# Altium schematic sheet Sheet1.SchDoc
size A4
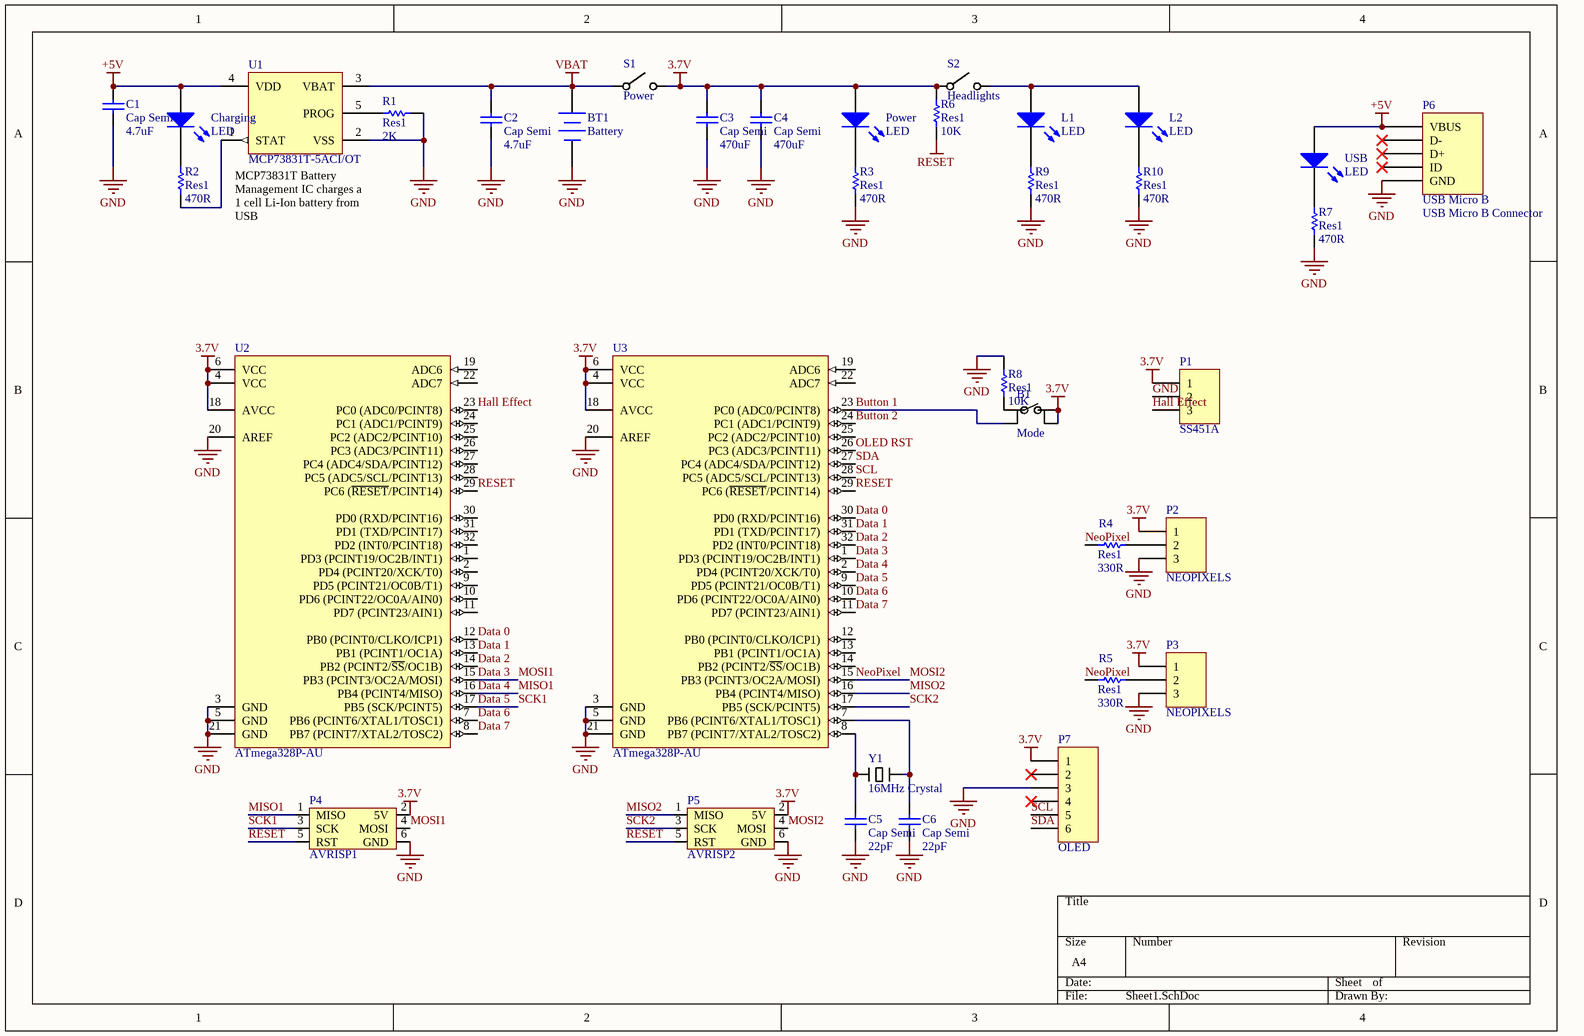
[diagram p0: Sheet1.SchDoc]

## Parts
B1  Mode  [SPST-NO]
BT1  Battery  [BAT-2]
C1  Cap Semi  value 4.7uF  [1608[0603]]
C2  Cap Semi  value 4.7uF  [1608[0603]]
C3  Cap Semi  value 470uF  [CAPAE9983X105M]
C4  Cap Semi  value 470uF  [CAPAE9983X105M]
C5  Cap Semi  value 22pF  [1608[0603]]
C6  Cap Semi  value 22pF  [1608[0603]]
Charging  LED  [LED0603]
L1  LED  [HDR1X2]
L2  LED  [HDR1X2]
P1  SS451A  [HDR1X3]
P2  NEOPIXELS  [HDR1X3]
P3  NEOPIXELS  [HDR1X3]
P4  AVRISP1  [HDR2X3]
P5  AVRISP2  [HDR2X3]
P6  USB Micro B Connector  [USB Micro B Connector]
P7  OLED  [HDR1X6]
Power  LED  [LED0603]
R1  Res1  value 2K  [1608[0603]]
R2  Res1  value 470R  [1608[0603]]
R3  Res1  value 470R  [1608[0603]]
R4  Res1  value 330R  [1608[0603]]
R5  Res1  value 330R  [1608[0603]]
R6  Res1  value 10K  [1608[0603]]
R7  Res1  value 470R  [1608[0603]]
R8  Res1  value 10K  [1608[0603]]
R9  Res1  value 470R  [1608[0603]]
R10  Res1  value 470R  [1608[0603]]
S1  Power  [Slide Switch 2.54mm]
S2  Headlights  [Slide Switch 2.54mm]
U1  MCP73831T-5ACI/OT  [SOT-23-OT5_N]
U2  ATmega328P-AU  [32A_N]
U3  ATmega328P-AU  [32A_N]
USB  LED  [LED0603]
Y1  16MHz Crystal  [16MHz Clock]

## Nets
3.7V: B1.3 B1.4 C3.2 C4.2 P1.1 P2.1 P3.1 P4.2(5V) P5.2(5V) P7.1 Power.1(A) R6.1 S1.2 S2.1 U2.4(VCC) U2.6(VCC) U2.18(AVCC) U3.4(VCC) U3.6(VCC) U3.18(AVCC)
+5V: C1.2 Charging.1(A) P6.VBUS U1.4(VDD) USB.1(A)
GND: BT1.2(-) C1.1 C2.1 C3.1 C4.1 C5.1 C6.1 P1.2 P2.3 P3.3 P4.6(GND) P5.6(GND) P6.GND P7.3 R1.1 R3.1 R7.1 R8.1 R9.1 R10.1 U1.2(VSS) U2.3(GND) U2.5(GND) U2.20(AREF) U2.21(GND) U3.3(GND) U3.5(GND) U3.20(AREF) U3.21(GND)
RESET: P4.5(RST) P5.5(RST) R6.2 U2.29(PC6_(~{RESET}/PCINT14)) U3.29(PC6_(~{RESET}/PCINT14))
VBAT: BT1.1(+) C2.2 S1.1 U1.3(VBAT)
Button 1: B1.2 U3.23(PC0_(ADC0/PCINT8))
Button 2: U3.24(PC1_(ADC1/PCINT9))
Data 0: U2.12(PB0_(PCINT0/CLKO/ICP1)) U3.30(PD0_(RXD/PCINT16))
Data 1: U2.13(PB1_(PCINT1/OC1A)) U3.31(PD1_(TXD/PCINT17))
Data 2: U2.14(PB2_(PCINT2/~{SS}/OC1B)) U3.32(PD2_(INT0/PCINT18))
Data 3: P4.4(MOSI) U2.15(PB3_(PCINT3/OC2A/MOSI)) U3.1(PD3_(PCINT19/OC2B/INT1))  [also labelled MOSI1]
Data 4: P4.1(MISO) U2.16(PB4_(PCINT4/MISO)) U3.2(PD4_(PCINT20/XCK/T0))  [also labelled MISO1]
Data 5: P4.3(SCK) U2.17(PB5_(SCK/PCINT5)) U3.9(PD5_(PCINT21/OC0B/T1))  [also labelled SCK1]
Data 6: U2.7(PB6_(PCINT6/XTAL1/TOSC1)) U3.10(PD6_(PCINT22/OC0A/AIN0))
Data 7: U2.8(PB7_(PCINT7/XTAL2/TOSC2)) U3.11(PD7_(PCINT23/AIN1))
Hall Effect: P1.3 U2.23(PC0_(ADC0/PCINT8))
MISO2: P5.1(MISO) U3.16(PB4_(PCINT4/MISO))
MOSI2: P5.4(MOSI) R4.1 R5.1 U3.15(PB3_(PCINT3/OC2A/MOSI))  [also labelled NeoPixel]
OLED RST: U3.26(PC3_(ADC3/PCINT11))
SCK2: P5.3(SCK) U3.17(PB5_(SCK/PCINT5))
SCL: P7.5 U3.28(PC5_(ADC5/SCL/PCINT13))
SDA: P7.6 U3.27(PC4_(ADC4/SDA/PCINT12))
NetB1_1: B1.1 R8.2
NetC5_2: C5.2 U3.8(PB7_(PCINT7/XTAL2/TOSC2)) Y1.1
NetC6_2: C6.2 U3.7(PB6_(PCINT6/XTAL1/TOSC1)) Y1.2
NetCharging_2: Charging.2(K) R2.2
NetL1_1: L1.1(A) L2.1(A) S2.2
NetL1_2: L1.2(K) R9.2
NetL2_2: L2.2(K) R10.2
NetP2_2: P2.2 R4.2
NetP3_2: P3.2 R5.2
NetPower_2: Power.2(K) R3.2
NetR1_2: R1.2 U1.5(PROG)
NetR2_1: R2.1 U1.1(STAT)
NetR7_2: R7.2 USB.2(K)

Not connected (* = marked no-connect by the designer): P6 D+* D-* ID*; P7 2* 4*; U2 1(PD3_(PCINT19/OC2B/INT1)) 2(PD4_(PCINT20/XCK/T0)) 9(PD5_(PCINT21/OC0B/T1)) 10(PD6_(PCINT22/OC0A/AIN0)) 11(PD7_(PCINT23/AIN1)) 19(ADC6) 22(ADC7) 24(PC1_(ADC1/PCINT9)) 25(PC2_(ADC2/PCINT10)) 26(PC3_(ADC3/PCINT11)) 27(PC4_(ADC4/SDA/PCINT12)) 28(PC5_(ADC5/SCL/PCINT13)) 30(PD0_(RXD/PCINT16)) 31(PD1_(TXD/PCINT17)) 32(PD2_(INT0/PCINT18)); U3 12(PB0_(PCINT0/CLKO/ICP1)) 13(PB1_(PCINT1/OC1A)) 14(PB2_(PCINT2/~{SS}/OC1B)) 19(ADC6) 22(ADC7) 25(PC2_(ADC2/PCINT10))

## Notes on the sheet
- (near U1) MCP73831T Battery Management IC charges a 1 cell Li-Ion battery from USB
- (in symbol USB Micro B Connector) USB Micro B

## Library data of the parts
B1 = Switch: pin to pad: 2>4 4>2
BT1 = Battery: Multicell Battery; Published: 24-Mar-1999; LatestRevisionDate: 17-Jul-2002; LatestRevisionNote: Re-released for DXP Platform.; PackageReference: BAT-2; Publisher: Altium Limited; PackageDescription: Battery; 2 Leads
C1-C6 = Cap Semi: Capacitor (Semiconductor SIM Model); Published: 8-Jun-2000; LatestRevisionDate: 29-May-2009; LatestRevisionNote: IPC-7351 Footprint Added.; PackageReference: C1206; Publisher: Altium Limited; PackageDescription: Chip Capacitor
Charging L1 L2 Power USB = LED3: Typical BLUE SiC LED; Published: 8-Jun-2000; LatestRevisionDate: 17-Dec-2003; LatestRevisionNote: PCB Footprint replaced.; DatasheetVersion: 16-Apr-2002; PackageVersion: 16-Apr-2002; PackageReference: 3.5X2.8X1.9; Publisher: Altium Limited; PackageDescription: SM LED; 2 C-Bend Leads; Body 3.5 x 2.8 x 1.9 mm, inc leads (LxWxH typ)
P1-P3 = Header 3: Header, 3-Pin; LatestRevisionDate: 17-Jul-2002; LatestRevisionNote: Re-released for DXP Platform.; Publisher: Altium Limited
P4 P5 = AVRISP
P7 = Header 6: Header, 6-Pin; LatestRevisionDate: 17-Jul-2002; LatestRevisionNote: Re-released for DXP Platform.; Publisher: Altium Limited
R1-R10 = Res1: Resistor; Published: 8-Jun-2000; LatestRevisionDate: 17-Jul-2002; LatestRevisionNote: Re-released for DXP Platform.; PackageReference: AXIAL-0.3; Publisher: Altium Limited; PackageDescription: Axial Device, Thru-Hole; 2 Leads; 0.3 in Pin Spacing
S1 S2 = Slide Switch
U1 = MCP73831T-5ACI/OT: Miniature Single-Cell, Fully Integrated Li-Ion, Li-Polymer Charge Management Controller, 4.5V, 5-Pin SOT-23, Industrial Temperature, Tape and Reel; Manufacturer: Microchip; DatasheetVersion: revE, Sep-2008; PackageVersion: revBB, Aug-2009; PackageReference: SOT-23-OT5; PackageDescription: 5-Lead Plastic Small Outline Transistor (OT) [SOT-23]; Supplier 1: Digi-Key; Supplier Part Number 1: MCP73831T-5ACI/OT-ND; Supplier 2: Mouser; Supplier Part Number 2: 579-MCP73831T5ACIOT; Mounting Technology: Surface Mount; Code_IPC: SOT23-5; PartNumber: MCP73831T-5ACI/OT; ComponentLink1Description: Manufacturer URL; ComponentLink1URL: http://www.microchip.com/; ComponentLink2Description: Datasheet; ComponentLink2URL: http://ww1.microchip.com/downloads/en/DeviceDoc/21984e.pdf; ComponentLink3Description: Package Specification; ComponentLink3URL: http://www.microchip.com/stellent/groups/techpub_sg/documents/packagingspec/en012702.pdf
U2 U3 = ATmega328P-AU: 8-bit AVR Microcontroller, 32KB Flash, 1KB EEPROM, 2KB SRAM, 32-pin TQFP, Industrial Grade (-40°C to 85°C); DatasheetVersion: revD, May-2011; PackageVersion: revC, Oct-2010; PackageReference: 32A; PackageDescription: 32-Lead, 7x7x1.0 mm Body, 0.8mm Lead Pitch, Thin Profile Plastic Quad Flat Package (TQFP); Code_JEDEC: MS-026-ABA; ComponentLink1Description: Manufacturer URL; ComponentLink1URL: http://www.atmel.com/; ComponentLink2Description: ATmega48A/48PA/88A/88PA/168A/168PA/328/328P Datasheet; ComponentLink2URL: http://www.atmel.com/dyn/resources/prod_documents/doc8271.pdf; ComponentLink3Description: ATmega48A/48PA/88A/88PA/168A/168PA/328/328P Summary; ComponentLink3URL: http://www.atmel.com/dyn/resources/prod_documents/8271S.pdf